# Altium schematic sheet ESP.SchDoc
size A
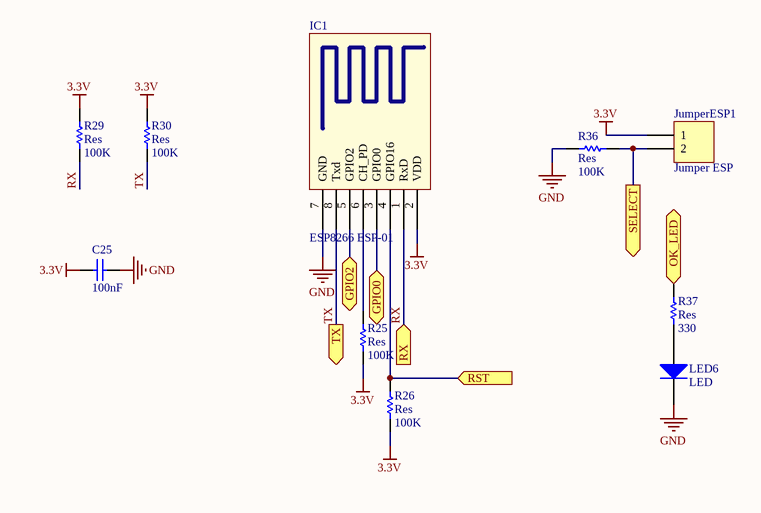
[diagram p0: ESP.SchDoc]

## Parts
C25  value 100nF  [2012[0805]]  (hidden comment: Cap_UP)
IC1  ESP8266 ESP-01  [ESP8266 ESP-01]
JumperESP1  Jumper ESP  [HDR1X2]
LED6  LED  [2012[0805]]
R25  Res  value 100K  [2012[0805]]
R26  Res  value 100K  [2012[0805]]
R29  Res  value 100K  [2012[0805]]
R30  Res  value 100K  [2012[0805]]
R36  Res  value 100K  [2012[0805]]
R37  Res  value 330  [2012[0805]]

## Ports
GPIO0 (bidir), GPIO2 (bidir), OK_LED (in), RST (in), RX (in), SELECT (out), TX (out)

## Nets
3.3V: C25.2 IC1.2(VDD) JumperESP1.1 R25.2 R26.1 R29.1 R30.1
GND: C25.1 IC1.7(GND) LED6.2(K) R36.1
GPIO0: IC1.3(GPIO0) ; port GPIO0
GPIO2: IC1.5(GPIO2) ; port GPIO2
OK_LED: R37.1 ; port OK_LED
RST: IC1.4(GPIO16) R26.2 ; port RST
RX: IC1.1(RxD) R29.2 ; port RX
SELECT: JumperESP1.2 R36.2 ; port SELECT
TX: IC1.8(Txd) R30.2 ; port TX
NetIC1_6: IC1.6(CH_PD) R25.1
NetLED6_1: LED6.1(A) R37.2

## Library data of the parts
C25 = Cap_UP: Capacitor; Published: 8-Jun-2000; LatestRevisionDate: 17-Jul-2002; LatestRevisionNote: Re-released for DXP Platform.; PackageReference: RAD-0.3; Publisher: Altium Limited
JumperESP1 = Header 2: Header, 2-Pin; LatestRevisionDate: 17-Jul-2002; LatestRevisionNote: Re-released for DXP Platform.; Publisher: Altium Limited
LED6 = Diode: 1 Amp General Purpose Rectifier; Revision 1: 11-Jul-2000: SIM Model Added.; Revision 2: 17-Jul-2002: Re-released for DXP Platform.; Package Information: Latest Revision: Aug-1999; Code - JEDEC: DO-204-AL; Published: 8-Jun-2000; Datasheet: Latest Revision: 1998; Package Reference: DO-41; Publisher: Altium Limited
R25 R26 R29 R30 R36 R37 = Res: Semiconductor Resistor; Published: 8-Jun-2000; LatestRevisionDate: 17-Jul-2002; LatestRevisionNote: Re-released for DXP Platform.; PackageReference: AXIAL-0.5; Publisher: Altium Limited